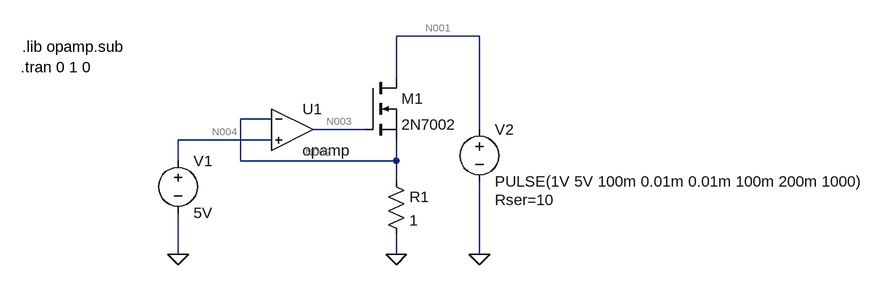
[diagram p0: schematic simulation-1.asc]
simulation-1.asc, the LTspice schematic file:
Version 4
SHEET 1 1096 680
WIRE 464 -16 336 -16
WIRE 336 48 336 -16
WIRE 144 112 96 112
WIRE 288 128 208 128
WIRE 464 128 464 -16
WIRE 144 144 0 144
WIRE 0 176 0 144
WIRE 96 176 96 112
WIRE 336 176 336 144
WIRE 336 176 96 176
WIRE 336 208 336 176
WIRE 0 320 0 256
WIRE 336 320 336 288
WIRE 464 320 464 208
FLAG 0 320 0
FLAG 336 320 0
FLAG 464 320 0
SYMBOL voltage 0 160 R0
WINDOW 123 0 0 Left 0
WINDOW 39 0 0 Left 0
SYMATTR InstName V1
SYMATTR Value 5V
SYMBOL voltage 464 112 R0
WINDOW 123 0 0 Left 0
WINDOW 39 24 124 Left 2
SYMATTR InstName V2
SYMATTR Value PULSE(1V 5V 100m 0.01m 0.01m 100m 200m 1000)
SYMATTR SpiceLine Rser=10
SYMBOL Opamps\\opamp 176 64 R0
SYMATTR InstName U1
SYMBOL res 320 192 R0
SYMATTR InstName R1
SYMATTR Value 1
SYMBOL nmos 288 48 R0
SYMATTR InstName M1
SYMATTR Value 2N7002
TEXT -242 32 Left 2 !.tran 0 1 0
TEXT -240 0 Left 2 !.lib opamp.sub

The netlist it stands for:
* simulation-1.asc
V1 N004 0 5V
V2 N001 0 PULSE(1V 5V 100m 0.01m 0.01m 100m 200m 1000) Rser=10
XU1 N002 N004 N003 opamp Aol=100K GBW=10Meg  ; pins invin noninvin out
R1 N002 0 1
M1 N001 N003 N002 N002 2N7002
.model NMOS NMOS
.model PMOS PMOS
.lib standard.mos
.tran 0 1 0
.lib opamp.sub
.backanno
.end

* Results of the author's LTspice run, read from the files saved beside the schematic
* Operating Point, zero values left out:
*   V(n004) = 5 V
*   V(n001) = 148.9 mV
*   V(n003) = 491.5 kV
*   V(n002) = 85.11 mV
*   Id(M1) = 85.1 mA
*   Is(M1) = -85.1 mA
*   I(R1) = 85.11 mA
*   I(V2) = -85.11 mA
*   Ix(u1:3) = 174.6 pA
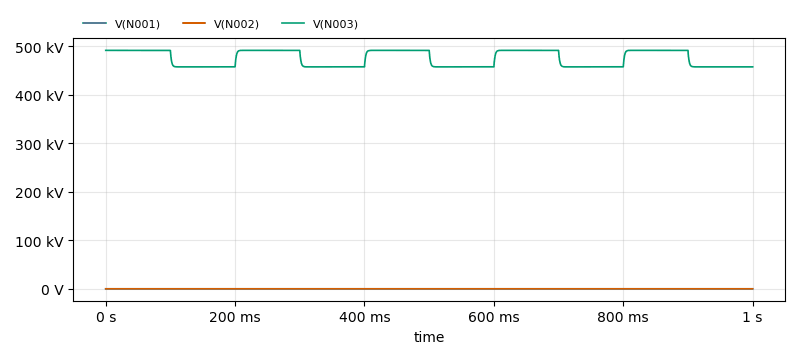
[diagram p1: Transient Analysis of simulation-1.asc, plotted from the saved traces]
* Transient Analysis, 1 run:
*   V(N001): min 148.9 mV, max 744.7 mV, average 446.8 mV, rms 537 mV, last 744.7 mV
*   V(N002): min 85.11 mV, max 425.5 mV, average 255.3 mV, rms 306.8 mV, last 425.5 mV
*   V(N003): min 457.4 kV, max 491.5 kV, average 474.5 kV, rms 474.8 kV, last 457.4 kV